# Altium schematic sheet DDR4_SDRAM.SchDoc: RFSoC AMC
size 420 x 297 mm; CompanyName: WUT; DrawnBy: T. Przywozki; Organization: WUT ISE; Address1: Warsaw University of Technology; Address2: Nowowiejska 15/19 00-665 Warsaw; Address3: Tomasz.Przywozki@pw.edu.pl; DocumentNumber: 14; Revision: 1; SheetNumber: 14; SheetTotal: 45; Project: RFSoC AMC; ModifiedBy: T. Przywozki; CreateDate: -; CheckedDate: -; DivGrp: ISE; Designer: T. Przywozki; ModifiedDate: -; ProjectName: ADC/DAC MEZZANINE
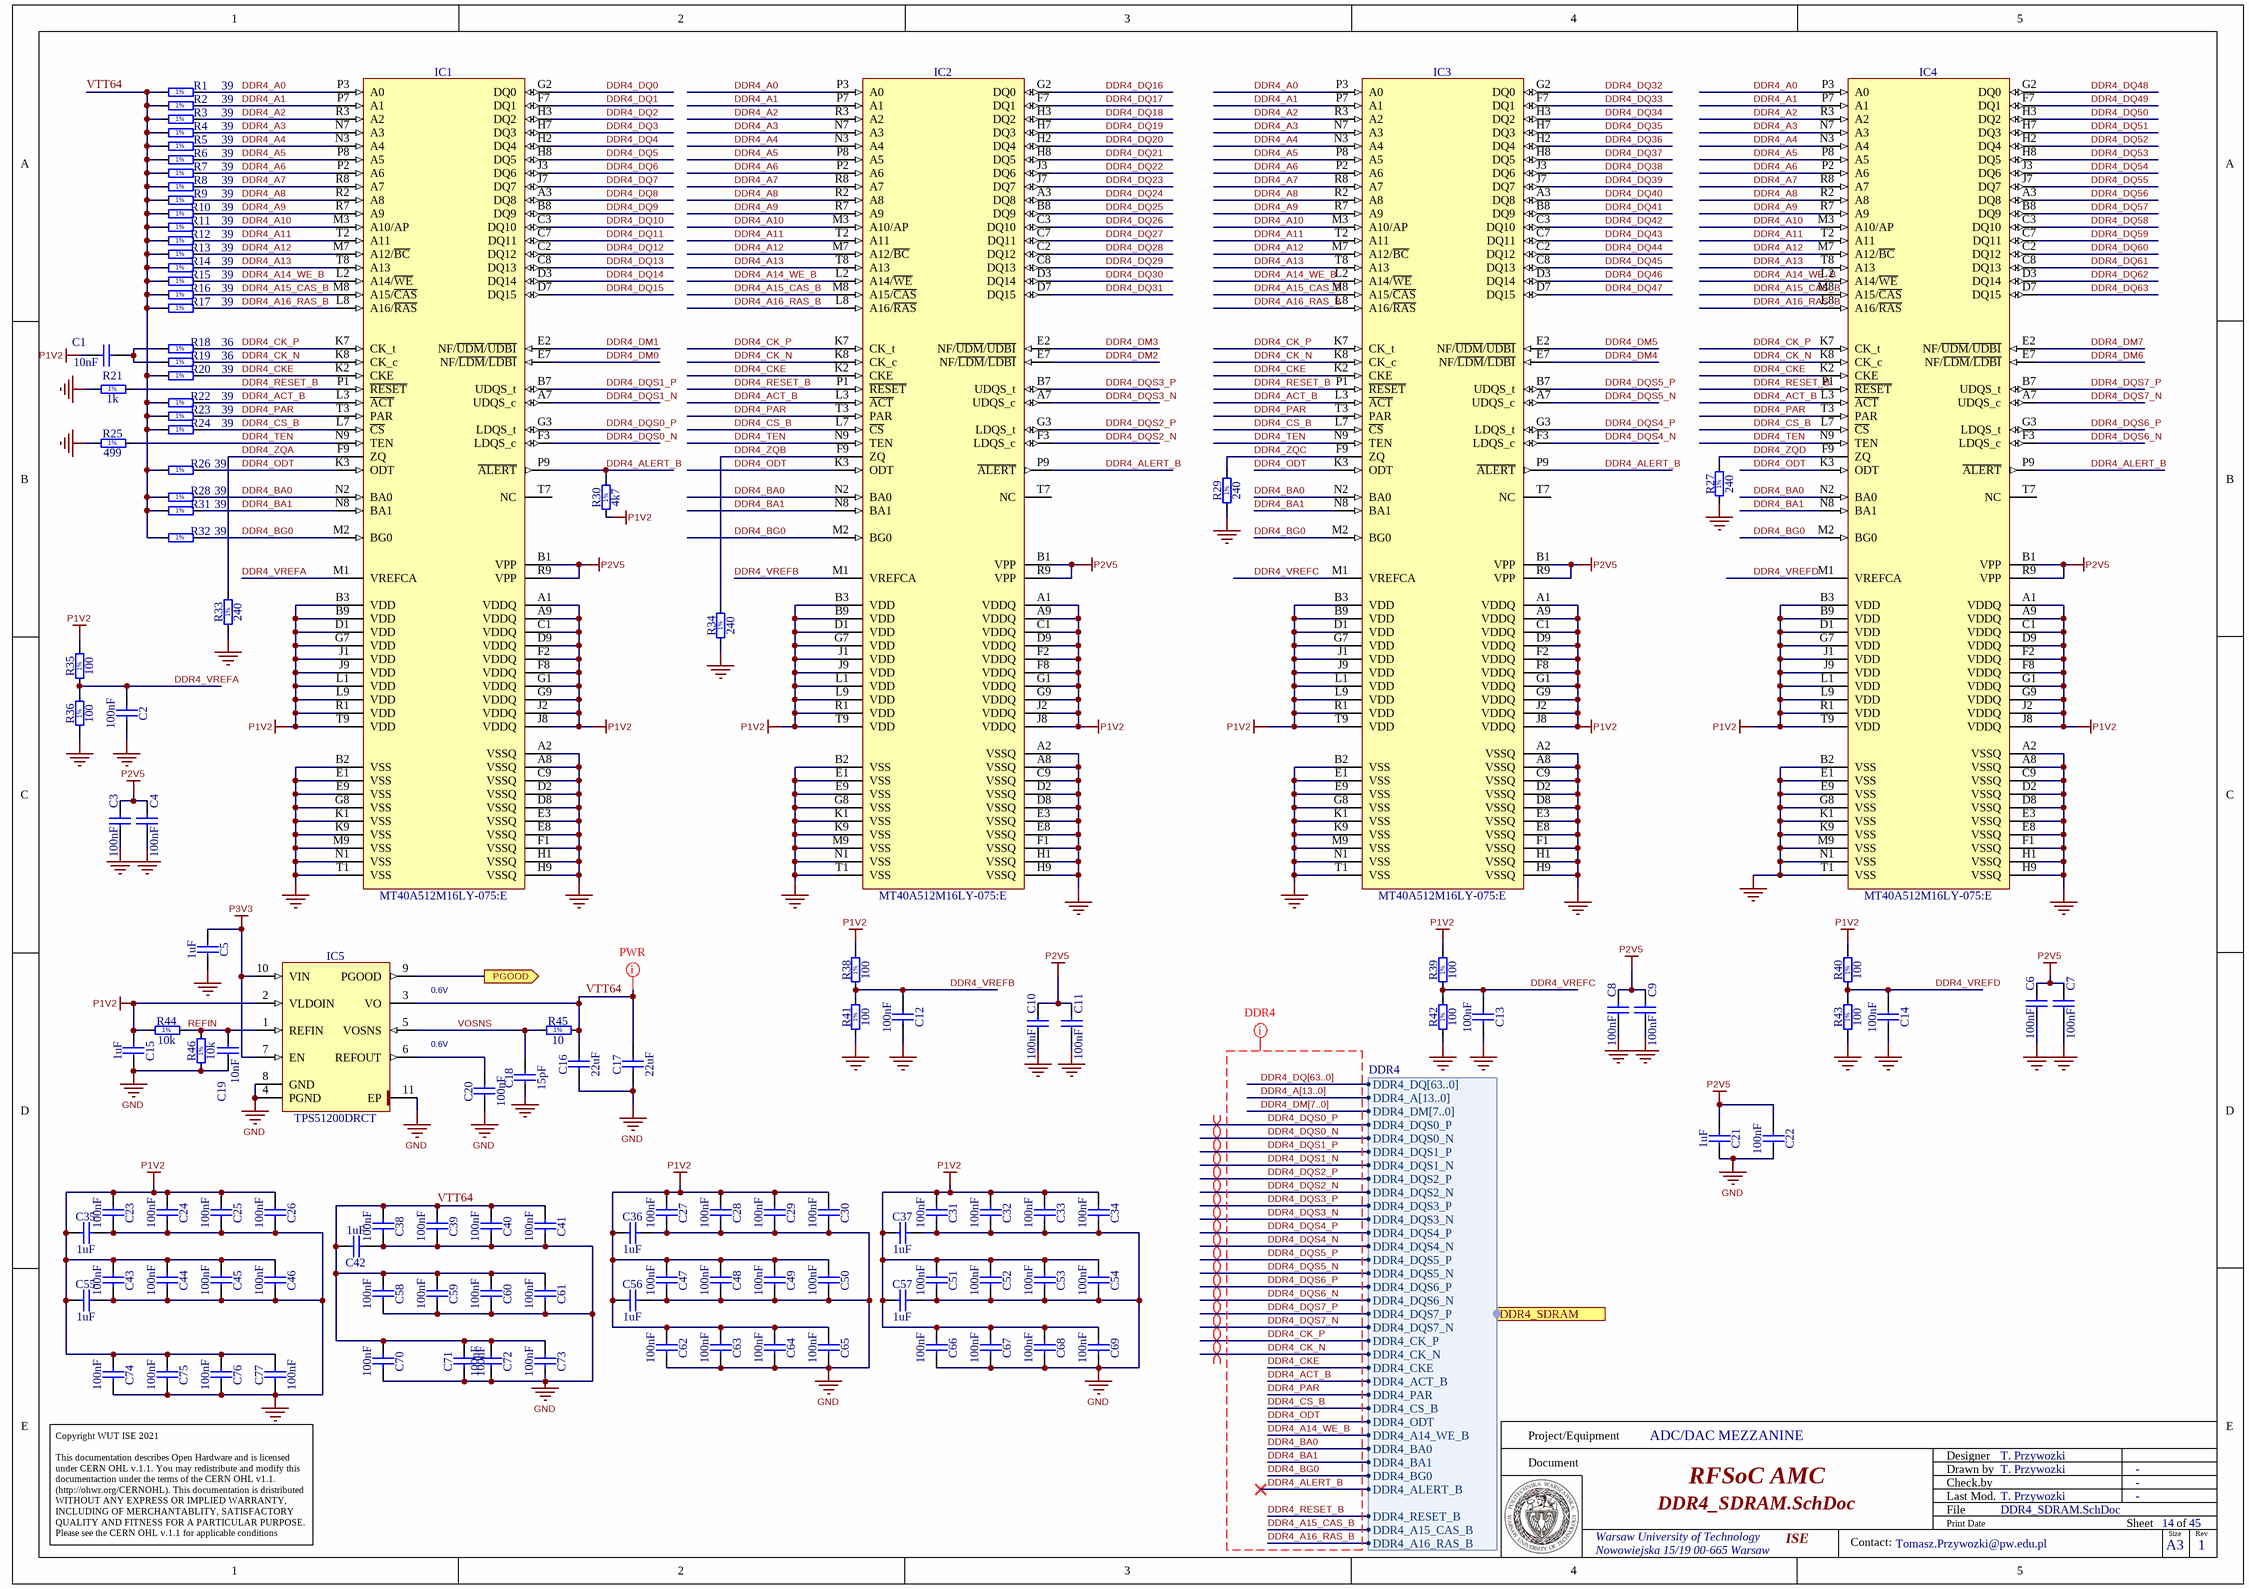
[diagram p0: DDR4_SDRAM.SchDoc]

## Parts
C1  10nF  [CAPC0603X33N]
C2  100nF  [CAPC0603X33N]
C3  100nF  [CAPC0603X33N]
C4  100nF  [CAPC0603X33N]
C5  1uF  [CAPC1005X55N]
C6  100nF  [CAPC0603X33N]
C7  100nF  [CAPC0603X33N]
C8  100nF  [CAPC0603X33N]
C9  100nF  [CAPC0603X33N]
C10  100nF  [CAPC0603X33N]
C11  100nF  [CAPC0603X33N]
C12  100nF  [CAPC0603X33N]
C13  100nF  [CAPC0603X33N]
C14  100nF  [CAPC0603X33N]
C15  1uF  [CAPC1005X55N]
C16  22uF  [CAPC2012X135N]
C17  22uF  [CAPC2012X135N]
C18  15pF  [CAPC1005X55N]
C19  10nF  [CAPC1005X55N]
C20  100nF  [CAPC0603X33N]
C21  1uF  [CAPC1005X55N]
C22  100nF  [CAPC0603X33N]
C23  100nF  [CAPC0603X33N]
C24  100nF  [CAPC0603X33N]
C25  100nF  [CAPC0603X33N]
C26  100nF  [CAPC0603X33N]
C27  100nF  [CAPC0603X33N]
C28  100nF  [CAPC0603X33N]
C29  100nF  [CAPC0603X33N]
C30  100nF  [CAPC0603X33N]
C31  100nF  [CAPC0603X33N]
C32  100nF  [CAPC0603X33N]
C33  100nF  [CAPC0603X33N]
C34  100nF  [CAPC0603X33N]
C35  1uF  [CAPC1005X55N]
C36  1uF  [CAPC1005X55N]
C37  1uF  [CAPC1005X55N]
C38  100nF  [CAPC0603X33N]
C39  100nF  [CAPC0603X33N]
C40  100nF  [CAPC0603X33N]
C41  100nF  [CAPC0603X33N]
C42  1uF  [CAPC1005X55N]
C43  100nF  [CAPC0603X33N]
C44  100nF  [CAPC0603X33N]
C45  100nF  [CAPC0603X33N]
C46  100nF  [CAPC0603X33N]
C47  100nF  [CAPC0603X33N]
C48  100nF  [CAPC0603X33N]
C49  100nF  [CAPC0603X33N]
C50  100nF  [CAPC0603X33N]
C51  100nF  [CAPC0603X33N]
C52  100nF  [CAPC0603X33N]
C53  100nF  [CAPC0603X33N]
C54  100nF  [CAPC0603X33N]
C55  1uF  [CAPC1005X55N]
C56  1uF  [CAPC1005X55N]
C57  1uF  [CAPC1005X55N]
C58  100nF  [CAPC0603X33N]
C59  100nF  [CAPC0603X33N]
C60  100nF  [CAPC0603X33N]
C61  100nF  [CAPC0603X33N]
C62  100nF  [CAPC0603X33N]
C63  100nF  [CAPC0603X33N]
C64  100nF  [CAPC0603X33N]
C65  100nF  [CAPC0603X33N]
C66  100nF  [CAPC0603X33N]
C67  100nF  [CAPC0603X33N]
C68  100nF  [CAPC0603X33N]
C69  100nF  [CAPC0603X33N]
C70  100nF  [CAPC0603X33N]
C71  100nF  [CAPC0603X33N]
C72  100nF  [CAPC0603X33N]
C73  100nF  [CAPC0603X33N]
C74  100nF  [CAPC0603X33N]
C75  100nF  [CAPC0603X33N]
C76  100nF  [CAPC0603X33N]
C77  100nF  [CAPC0603X33N]
IC1  MT40A512M16LY-075:E  [BGA96C80P9X16_750X1350X120]
IC2  MT40A512M16LY-075:E  [BGA96C80P9X16_750X1350X120]
IC3  MT40A512M16LY-075:E  [BGA96C80P9X16_750X1350X120]
IC4  MT40A512M16LY-075:E  [BGA96C80P9X16_750X1350X120]
IC5  TPS51200DRCT  [TEXAS_DRC (S-PVSON-N10)]
R1  39  [RESC1005X40N]
R2  39  [RESC1005X40N]
R3  39  [RESC1005X40N]
R4  39  [RESC1005X40N]
R5  39  [RESC1005X40N]
R6  39  [RESC1005X40N]
R7  39  [RESC1005X40N]
R8  39  [RESC1005X40N]
R9  39  [RESC1005X40N]
R10  39  [RESC1005X40N]
R11  39  [RESC1005X40N]
R12  39  [RESC1005X40N]
R13  39  [RESC1005X40N]
R14  39  [RESC1005X40N]
R15  39  [RESC1005X40N]
R16  39  [RESC1005X40N]
R17  39  [RESC1005X40N]
R18  36  [RESC1005X40N]
R19  36  [RESC1005X40N]
R20  39  [RESC1005X40N]
R21  1k  [RESC1005X40N]
R22  39  [RESC1005X40N]
R23  39  [RESC1005X40N]
R24  39  [RESC1005X40N]
R25  499  [RESC1005X40N]
R26  39  [RESC1005X40N]
R27  240  [RESC1005X40N]
R28  39  [RESC1005X40N]
R29  240  [RESC1005X40N]
R30  4k7  [RESC1005X40N]
R31  39  [RESC1005X40N]
R32  39  [RESC1005X40N]
R33  240  [RESC1005X40N]
R34  240  [RESC1005X40N]
R35  100  [RESC1005X40N]
R36  100  [RESC1005X40N]
R38  100  [RESC1005X40N]
R39  100  [RESC1005X40N]
R40  100  [RESC1005X40N]
R41  100  [RESC1005X40N]
R42  100  [RESC1005X40N]
R43  100  [RESC1005X40N]
R44  10k  [RESC1005X40N]
R45  10  [RESC1005X40N]
R46  10k  [RESC1005X40N]

## Ports
DDR4_SDRAM (harness DDR4), PGOOD (out)

## Harnesses
DDR4: DDR4_DQ[63..0], DDR4_A[13..0], DDR4_DM[7..0], DDR4_DQS0_P, DDR4_DQS0_N, DDR4_DQS1_P, DDR4_DQS1_N, DDR4_DQS2_P, DDR4_DQS2_N, DDR4_DQS3_P, DDR4_DQS3_N, DDR4_DQS4_P, DDR4_DQS4_N, DDR4_DQS5_P, DDR4_DQS5_N, DDR4_DQS6_P, DDR4_DQS6_N, DDR4_DQS7_P, DDR4_DQS7_N, DDR4_CK_P, DDR4_CK_N, DDR4_CKE, DDR4_ACT_B, DDR4_PAR, DDR4_CS_B, DDR4_ODT, DDR4_A14_WE_B, DDR4_BA0, DDR4_BA1, DDR4_BG0, DDR4_ALERT_B, DDR4_RESET_B, DDR4_A15_CAS_B, DDR4_A16_RAS_B

## Nets
GND: C2.2 C3.2 C4.2 C5.2 C6.2 C7.2 C8.2 C9.2 C10.2 C11.2 C12.2 C13.2 C14.2 C15.2 C16.1 C17.1 C18.1 C19.1 C20.1 C21.2 C22.2 C23.2 C24.2 C25.2 C26.2 C27.2 C28.2 C29.2 C30.2 C31.2 C32.2 C33.2 C34.2 C35.2 C36.2 C37.2 C38.2 C39.2 C40.2 C41.2 C42.2 C43.2 C44.2 C45.2 C46.2 C47.2 C48.2 C49.2 C50.2 C51.2 C52.2 C53.2 C54.2 C55.2 C56.2 C57.2 C58.2 C59.2 C60.2 C61.2 C62.2 C63.2 C64.2 C65.2 C66.2 C67.2 C68.2 C69.2 C70.2 C71.2 C72.2 C73.2 C74.2 C75.2 C76.2 C77.1 IC1.A2(VSSQ) IC1.A8(VSSQ) IC1.B2(VSS) IC1.C9(VSSQ) IC1.D2(VSSQ) IC1.D8(VSSQ) IC1.E1(VSS) IC1.E3(VSSQ) IC1.E8(VSSQ) IC1.E9(VSS) IC1.F1(VSSQ) IC1.G8(VSS) IC1.H1(VSSQ) IC1.H9(VSSQ) IC1.K1(VSS) IC1.K9(VSS) IC1.M9(VSS) IC1.N1(VSS) IC1.T1(VSS) IC2.A2(VSSQ) IC2.A8(VSSQ) IC2.B2(VSS) IC2.C9(VSSQ) IC2.D2(VSSQ) IC2.D8(VSSQ) IC2.E1(VSS) IC2.E3(VSSQ) IC2.E8(VSSQ) IC2.E9(VSS) IC2.F1(VSSQ) IC2.G8(VSS) IC2.H1(VSSQ) IC2.H9(VSSQ) IC2.K1(VSS) IC2.K9(VSS) IC2.M9(VSS) IC2.N1(VSS) IC2.T1(VSS) IC3.A2(VSSQ) IC3.A8(VSSQ) IC3.B2(VSS) IC3.C9(VSSQ) IC3.D2(VSSQ) IC3.D8(VSSQ) IC3.E1(VSS) IC3.E3(VSSQ) IC3.E8(VSSQ) IC3.E9(VSS) IC3.F1(VSSQ) IC3.G8(VSS) IC3.H1(VSSQ) IC3.H9(VSSQ) IC3.K1(VSS) IC3.K9(VSS) IC3.M9(VSS) IC3.N1(VSS) IC3.T1(VSS) IC4.A2(VSSQ) IC4.A8(VSSQ) IC4.B2(VSS) IC4.C9(VSSQ) IC4.D2(VSSQ) IC4.D8(VSSQ) IC4.E1(VSS) IC4.E3(VSSQ) IC4.E8(VSSQ) IC4.E9(VSS) IC4.F1(VSSQ) IC4.G8(VSS) IC4.H1(VSSQ) IC4.H9(VSSQ) IC4.K1(VSS) IC4.K9(VSS) IC4.M9(VSS) IC4.N1(VSS) IC4.T1(VSS) IC5.4(PGND) IC5.8(GND) IC5.11(EP) R21.1 R25.1 R27.1 R29.1 R33.1 R34.1 R36.1 R41.1 R42.1 R43.1 R46.1
P1V2: C1.1 C15.1 C23.1 C24.1 C25.1 C26.1 C27.1 C28.1 C29.1 C30.1 C31.1 C32.1 C33.1 C34.1 C35.1 C36.1 C37.1 C43.1 C44.1 C45.1 C46.1 C47.1 C48.1 C49.1 C50.1 C51.1 C52.1 C53.1 C54.1 C55.1 C56.1 C57.1 C62.1 C63.1 C64.1 C65.1 C66.1 C67.1 C68.1 C69.1 C74.1 C75.1 C76.1 C77.2 IC1.A1(VDDQ) IC1.A9(VDDQ) IC1.B3(VDD) IC1.B9(VDD) IC1.C1(VDDQ) IC1.D1(VDD) IC1.D9(VDDQ) IC1.F2(VDDQ) IC1.F8(VDDQ) IC1.G1(VDDQ) IC1.G7(VDD) IC1.G9(VDDQ) IC1.J1(VDD) IC1.J2(VDDQ) IC1.J8(VDDQ) IC1.J9(VDD) IC1.L1(VDD) IC1.L9(VDD) IC1.R1(VDD) IC1.T9(VDD) IC2.A1(VDDQ) IC2.A9(VDDQ) IC2.B3(VDD) IC2.B9(VDD) IC2.C1(VDDQ) IC2.D1(VDD) IC2.D9(VDDQ) IC2.F2(VDDQ) IC2.F8(VDDQ) IC2.G1(VDDQ) IC2.G7(VDD) IC2.G9(VDDQ) IC2.J1(VDD) IC2.J2(VDDQ) IC2.J8(VDDQ) IC2.J9(VDD) IC2.L1(VDD) IC2.L9(VDD) IC2.R1(VDD) IC2.T9(VDD) IC3.A1(VDDQ) IC3.A9(VDDQ) IC3.B3(VDD) IC3.B9(VDD) IC3.C1(VDDQ) IC3.D1(VDD) IC3.D9(VDDQ) IC3.F2(VDDQ) IC3.F8(VDDQ) IC3.G1(VDDQ) IC3.G7(VDD) IC3.G9(VDDQ) IC3.J1(VDD) IC3.J2(VDDQ) IC3.J8(VDDQ) IC3.J9(VDD) IC3.L1(VDD) IC3.L9(VDD) IC3.R1(VDD) IC3.T9(VDD) IC4.A1(VDDQ) IC4.A9(VDDQ) IC4.B3(VDD) IC4.B9(VDD) IC4.C1(VDDQ) IC4.D1(VDD) IC4.D9(VDDQ) IC4.F2(VDDQ) IC4.F8(VDDQ) IC4.G1(VDDQ) IC4.G7(VDD) IC4.G9(VDDQ) IC4.J1(VDD) IC4.J2(VDDQ) IC4.J8(VDDQ) IC4.J9(VDD) IC4.L1(VDD) IC4.L9(VDD) IC4.R1(VDD) IC4.T9(VDD) IC5.2(VLDOIN) R30.1 R35.2 R38.2 R39.2 R40.2 R44.1
P2V5: C3.1 C4.1 C6.1 C7.1 C8.1 C9.1 C10.1 C11.1 C21.1 C22.1 IC1.B1(VPP) IC1.R9(VPP) IC2.B1(VPP) IC2.R9(VPP) IC3.B1(VPP) IC3.R9(VPP) IC4.B1(VPP) IC4.R9(VPP)
P3V3: C5.1 IC5.7(EN) IC5.10(VIN)
DDR4_A0: IC1.P3(A0) IC2.P3(A0) IC3.P3(A0) IC4.P3(A0) R1.2
DDR4_A1: IC1.P7(A1) IC2.P7(A1) IC3.P7(A1) IC4.P7(A1) R2.2
DDR4_A2: IC1.R3(A2) IC2.R3(A2) IC3.R3(A2) IC4.R3(A2) R3.2
DDR4_A3: IC1.N7(A3) IC2.N7(A3) IC3.N7(A3) IC4.N7(A3) R4.2
DDR4_A4: IC1.N3(A4) IC2.N3(A4) IC3.N3(A4) IC4.N3(A4) R5.2
DDR4_A5: IC1.P8(A5) IC2.P8(A5) IC3.P8(A5) IC4.P8(A5) R6.2
DDR4_A6: IC1.P2(A6) IC2.P2(A6) IC3.P2(A6) IC4.P2(A6) R7.2
DDR4_A7: IC1.R8(A7) IC2.R8(A7) IC3.R8(A7) IC4.R8(A7) R8.2
DDR4_A8: IC1.R2(A8) IC2.R2(A8) IC3.R2(A8) IC4.R2(A8) R9.2
DDR4_A9: IC1.R7(A9) IC2.R7(A9) IC3.R7(A9) IC4.R7(A9) R10.2
DDR4_A10: IC1.M3(A10/AP) IC2.M3(A10/AP) IC3.M3(A10/AP) IC4.M3(A10/AP) R11.2
DDR4_A11: IC1.T2(A11) IC2.T2(A11) IC3.T2(A11) IC4.T2(A11) R12.2
DDR4_A12: IC1.M7(A12/~{BC}) IC2.M7(A12/~{BC}) IC3.M7(A12/~{BC}) IC4.M7(A12/~{BC}) R13.2
DDR4_A13: IC1.T8(A13) IC2.T8(A13) IC3.T8(A13) IC4.T8(A13) R14.2
DDR4_A14_WE_B: IC1.L2(A14/~{WE}) IC2.L2(A14/~{WE}) IC3.L2(A14/~{WE}) IC4.L2(A14/~{WE}) R15.2 ; port DDR4_SDRAM.DDR4_A14_WE_B
DDR4_A15_CAS_B: IC1.M8(A15/~{CAS}) IC2.M8(A15/~{CAS}) IC3.M8(A15/~{CAS}) IC4.M8(A15/~{CAS}) R16.2 ; port DDR4_SDRAM.DDR4_A15_CAS_B
DDR4_A16_RAS_B: IC1.L8(A16/~{RAS}) IC2.L8(A16/~{RAS}) IC3.L8(A16/~{RAS}) IC4.L8(A16/~{RAS}) R17.2 ; port DDR4_SDRAM.DDR4_A16_RAS_B
DDR4_ACT_B: IC1.L3(~{ACT}) IC2.L3(~{ACT}) IC3.L3(~{ACT}) IC4.L3(~{ACT}) R22.2 ; port DDR4_SDRAM.DDR4_ACT_B
DDR4_ALERT_B: IC1.P9(~{ALERT}) IC2.P9(~{ALERT}) IC3.P9(~{ALERT}) IC4.P9(~{ALERT}) R30.2 ; port DDR4_SDRAM.DDR4_ALERT_B
DDR4_BA0: IC1.N2(BA0) IC2.N2(BA0) IC3.N2(BA0) IC4.N2(BA0) R28.2 ; port DDR4_SDRAM.DDR4_BA0
DDR4_BA1: IC1.N8(BA1) IC2.N8(BA1) IC3.N8(BA1) IC4.N8(BA1) R31.2 ; port DDR4_SDRAM.DDR4_BA1
DDR4_BG0: IC1.M2(BG0) IC2.M2(BG0) IC3.M2(BG0) IC4.M2(BG0) R32.2 ; port DDR4_SDRAM.DDR4_BG0
DDR4_CK_N: IC1.K8(CK_c) IC2.K8(CK_c) IC3.K8(CK_c) IC4.K8(CK_c) R19.2 ; port DDR4_SDRAM.DDR4_CK_N
DDR4_CK_P: IC1.K7(CK_t) IC2.K7(CK_t) IC3.K7(CK_t) IC4.K7(CK_t) R18.2 ; port DDR4_SDRAM.DDR4_CK_P
DDR4_CKE: IC1.K2(CKE) IC2.K2(CKE) IC3.K2(CKE) IC4.K2(CKE) R20.2 ; port DDR4_SDRAM.DDR4_CKE
DDR4_CS_B: IC1.L7(~{CS}) IC2.L7(~{CS}) IC3.L7(~{CS}) IC4.L7(~{CS}) R24.2 ; port DDR4_SDRAM.DDR4_CS_B
DDR4_DM0: IC1.E7(NF/~{LDM}/~{LDBI})
DDR4_DM1: IC1.E2(NF/~{UDM}/~{UDBI})
DDR4_DM2: IC2.E7(NF/~{LDM}/~{LDBI})
DDR4_DM3: IC2.E2(NF/~{UDM}/~{UDBI})
DDR4_DM4: IC3.E7(NF/~{LDM}/~{LDBI})
DDR4_DM5: IC3.E2(NF/~{UDM}/~{UDBI})
DDR4_DM6: IC4.E7(NF/~{LDM}/~{LDBI})
DDR4_DM7: IC4.E2(NF/~{UDM}/~{UDBI})
DDR4_DQ0: IC1.G2(DQ0)
DDR4_DQ1: IC1.F7(DQ1)
DDR4_DQ2: IC1.H3(DQ2)
DDR4_DQ3: IC1.H7(DQ3)
DDR4_DQ4: IC1.H2(DQ4)
DDR4_DQ5: IC1.H8(DQ5)
DDR4_DQ6: IC1.J3(DQ6)
DDR4_DQ7: IC1.J7(DQ7)
DDR4_DQ8: IC1.A3(DQ8)
DDR4_DQ9: IC1.B8(DQ9)
DDR4_DQ10: IC1.C3(DQ10)
DDR4_DQ11: IC1.C7(DQ11)
DDR4_DQ12: IC1.C2(DQ12)
DDR4_DQ13: IC1.C8(DQ13)
DDR4_DQ14: IC1.D3(DQ14)
DDR4_DQ15: IC1.D7(DQ15)
DDR4_DQ16: IC2.G2(DQ0)
DDR4_DQ17: IC2.F7(DQ1)
DDR4_DQ18: IC2.H3(DQ2)
DDR4_DQ19: IC2.H7(DQ3)
DDR4_DQ20: IC2.H2(DQ4)
DDR4_DQ21: IC2.H8(DQ5)
DDR4_DQ22: IC2.J3(DQ6)
DDR4_DQ23: IC2.J7(DQ7)
DDR4_DQ24: IC2.A3(DQ8)
DDR4_DQ25: IC2.B8(DQ9)
DDR4_DQ26: IC2.C3(DQ10)
DDR4_DQ27: IC2.C7(DQ11)
DDR4_DQ28: IC2.C2(DQ12)
DDR4_DQ29: IC2.C8(DQ13)
DDR4_DQ30: IC2.D3(DQ14)
DDR4_DQ31: IC2.D7(DQ15)
DDR4_DQ32: IC3.G2(DQ0)
DDR4_DQ33: IC3.F7(DQ1)
DDR4_DQ34: IC3.H3(DQ2)
DDR4_DQ35: IC3.H7(DQ3)
DDR4_DQ36: IC3.H2(DQ4)
DDR4_DQ37: IC3.H8(DQ5)
DDR4_DQ38: IC3.J3(DQ6)
DDR4_DQ39: IC3.J7(DQ7)
DDR4_DQ40: IC3.A3(DQ8)
DDR4_DQ41: IC3.B8(DQ9)
DDR4_DQ42: IC3.C3(DQ10)
DDR4_DQ43: IC3.C7(DQ11)
DDR4_DQ44: IC3.C2(DQ12)
DDR4_DQ45: IC3.C8(DQ13)
DDR4_DQ46: IC3.D3(DQ14)
DDR4_DQ47: IC3.D7(DQ15)
DDR4_DQ48: IC4.G2(DQ0)
DDR4_DQ49: IC4.F7(DQ1)
DDR4_DQ50: IC4.H3(DQ2)
DDR4_DQ51: IC4.H7(DQ3)
DDR4_DQ52: IC4.H2(DQ4)
DDR4_DQ53: IC4.H8(DQ5)
DDR4_DQ54: IC4.J3(DQ6)
DDR4_DQ55: IC4.J7(DQ7)
DDR4_DQ56: IC4.A3(DQ8)
DDR4_DQ57: IC4.B8(DQ9)
DDR4_DQ58: IC4.C3(DQ10)
DDR4_DQ59: IC4.C7(DQ11)
DDR4_DQ60: IC4.C2(DQ12)
DDR4_DQ61: IC4.C8(DQ13)
DDR4_DQ62: IC4.D3(DQ14)
DDR4_DQ63: IC4.D7(DQ15)
DDR4_DQS0_N: IC1.F3(LDQS_c) ; port DDR4_SDRAM.DDR4_DQS0_N
DDR4_DQS0_P: IC1.G3(LDQS_t) ; port DDR4_SDRAM.DDR4_DQS0_P
DDR4_DQS1_N: IC1.A7(UDQS_c) ; port DDR4_SDRAM.DDR4_DQS1_N
DDR4_DQS1_P: IC1.B7(UDQS_t) ; port DDR4_SDRAM.DDR4_DQS1_P
DDR4_DQS2_N: IC2.F3(LDQS_c) ; port DDR4_SDRAM.DDR4_DQS2_N
DDR4_DQS2_P: IC2.G3(LDQS_t) ; port DDR4_SDRAM.DDR4_DQS2_P
DDR4_DQS3_N: IC2.A7(UDQS_c) ; port DDR4_SDRAM.DDR4_DQS3_N
DDR4_DQS3_P: IC2.B7(UDQS_t) ; port DDR4_SDRAM.DDR4_DQS3_P
DDR4_DQS4_N: IC3.F3(LDQS_c) ; port DDR4_SDRAM.DDR4_DQS4_N
DDR4_DQS4_P: IC3.G3(LDQS_t) ; port DDR4_SDRAM.DDR4_DQS4_P
DDR4_DQS5_N: IC3.A7(UDQS_c) ; port DDR4_SDRAM.DDR4_DQS5_N
DDR4_DQS5_P: IC3.B7(UDQS_t) ; port DDR4_SDRAM.DDR4_DQS5_P
DDR4_DQS6_N: IC4.F3(LDQS_c) ; port DDR4_SDRAM.DDR4_DQS6_N
DDR4_DQS6_P: IC4.G3(LDQS_t) ; port DDR4_SDRAM.DDR4_DQS6_P
DDR4_DQS7_N: IC4.A7(UDQS_c) ; port DDR4_SDRAM.DDR4_DQS7_N
DDR4_DQS7_P: IC4.B7(UDQS_t) ; port DDR4_SDRAM.DDR4_DQS7_P
DDR4_ODT: IC1.K3(ODT) IC2.K3(ODT) IC3.K3(ODT) IC4.K3(ODT) R26.2 ; port DDR4_SDRAM.DDR4_ODT
DDR4_PAR: IC1.T3(PAR) IC2.T3(PAR) IC3.T3(PAR) IC4.T3(PAR) R23.2 ; port DDR4_SDRAM.DDR4_PAR
DDR4_RESET_B: IC1.P1(~{RESET}) IC2.P1(~{RESET}) IC3.P1(~{RESET}) IC4.P1(~{RESET}) R21.2 ; port DDR4_SDRAM.DDR4_RESET_B
DDR4_TEN: IC1.N9(TEN) IC2.N9(TEN) IC3.N9(TEN) IC4.N9(TEN) R25.2
DDR4_VREFA: C2.1 IC1.M1(VREFCA) R35.1 R36.2
DDR4_VREFB: C12.1 IC2.M1(VREFCA) R38.1 R41.2
DDR4_VREFC: C13.1 IC3.M1(VREFCA) R39.1 R42.2
DDR4_VREFD: C14.1 IC4.M1(VREFCA) R40.1 R43.2
DDR4_ZQA: IC1.F9(ZQ) R33.2
DDR4_ZQB: IC2.F9(ZQ) R34.2
DDR4_ZQC: IC3.F9(ZQ) R29.2
DDR4_ZQD: IC4.F9(ZQ) R27.2
PGOOD: IC5.9(PGOOD) ; port PGOOD
REFIN: C19.2 IC5.1(REFIN) R44.2 R46.2
VOSNS: C18.2 IC5.5(VOSNS) R45.1
VTT64: C16.2 C17.2 C38.1 C39.1 C40.1 C41.1 C42.1 C58.1 C59.1 C60.1 C61.1 C70.1 C71.1 C72.1 C73.1 IC5.3(VO) R1.1 R2.1 R3.1 R4.1 R5.1 R6.1 R7.1 R8.1 R9.1 R10.1 R11.1 R12.1 R13.1 R14.1 R15.1 R16.1 R17.1 R20.1 R22.1 R23.1 R24.1 R26.1 R28.1 R31.1 R32.1 R45.2
NetC1_2: C1.2 R18.1 R19.1
NetC20_2: C20.2 IC5.6(REFOUT)

Not connected (* = marked no-connect by the designer): IC1 T7(NC); IC2 T7(NC); IC3 T7(NC); IC4 T7(NC)

## Buses and harness runs
bus DDR4_A[13..0]
bus DDR4_DM[7..0]
bus DDR4_DQ[63..0]

## Layout directives
differential pair; differential pair class DDR_DIFF: DDR4_CK_N, DDR4_CK_P, DDR4_DQS0_N, DDR4_DQS0_P, DDR4_DQS1_N, DDR4_DQS1_P, DDR4_DQS2_N, DDR4_DQS2_P, DDR4_DQS3_N, DDR4_DQS3_P, DDR4_DQS4_N, DDR4_DQS4_P, DDR4_DQS5_N, DDR4_DQS5_P, DDR4_DQS6_N, DDR4_DQS6_P, DDR4_DQS7_N, DDR4_DQS7_P
net class DDR4: DDR4_A14_WE_B, DDR4_A15_CAS_B, DDR4_A16_RAS_B, DDR4_A[13..0], DDR4_ACT_B, DDR4_ALERT_B, DDR4_BA0, DDR4_BA1, DDR4_BG0, DDR4_CK_N, DDR4_CK_P, DDR4_CKE, DDR4_CS_B, DDR4_DM[7..0], DDR4_DQ[63..0], DDR4_DQS0_N, DDR4_DQS0_P, DDR4_DQS1_N, DDR4_DQS1_P, DDR4_DQS2_N, DDR4_DQS2_P, DDR4_DQS3_N, DDR4_DQS3_P, DDR4_DQS4_N, DDR4_DQS4_P, DDR4_DQS5_N, DDR4_DQS5_P, DDR4_DQS6_N, DDR4_DQS6_P, DDR4_DQS7_N, DDR4_DQS7_P, DDR4_ODT, DDR4_PAR, DDR4_RESET_B
net class PWR: VTT64

## Notes on the sheet
- (near IC5) 0.6V
- 0.6V
- Project/Equipment
- Document
- Designer
- Drawn by
- Check.by
- Copyright WUT ISE 2021
  This documentation describes Open Hardware and is licensed under CERN OHL v.1.1. You may redistribute and modify this documentaction under the terms of the CERN OHL v1.1.
  (http://ohwr.org/CERNOHL). This documentation is dristributed WITHOUT ANY EXPRESS OR IMPLIED WARRANTY, INCLUDING OF MERCHANTABLITY, SATISFACTORY QUALITY AND FITNESS FOR A PARTICULAR PURPOSE. Please see the CERN OHL v.1.1 for applicable conditions
- File
- Last Mod.
- Print Date
- Sheet
- Size
- A3
- of
- Rev
- Contact:
- (in symbol R0402_1K_1%_0.0625W_100PPM) 1%
- (in symbol R0402_4K7_1%_0.0625W_100PPM) 1%
- (in symbol R0402_10K_1%_0.0625W_100PPM) 1%
- (in symbol R0402_10R_1%_0.0625W_200PPM) 1%
- (in symbol R0402_36R_1%_0.0625W_100PPM) 1%
- (in symbol R0402_39R_1%_0.0625W_100PPM) 1%
- (in symbol R0402_100R_1%_0.0625W_100PPM) 1%
- (in symbol R0402_240R_1%_0.0625W_100PPM) 1%
- (in symbol R0402_499R_1%_0.0625W_100PPM) 1%

## Library data of the parts
C1 = CC0201_10NF_10V_10%_X5R: Non-polarised capacitor; Part Description: SMD Multilayer Chip Ceramic Capacitor; Manufacturer: GENERIC; Manufacturer1 Part Number: 0201ZD103KAT2A; Voltage: 10V; TC: X5R; Tolerance: ±10%; Part Number: CC0201_10NF_10V_10%_X5R; Component Kind: Standard; Component Type: Standard; Pin Count: 2; Value: 10nF; Status: Not Recommended; Manufacturer Part Number: CC0201_10NF_10V_10%_X5R; Case: 0201; Mounted: Yes; Socket: No; SMD: Yes; Sense: No; Manufacturer1 Example: AVX; Manufacturer1 ComponentHeight: 0.33mm; HelpURL: \\cern.ch\dfs\Applications\Altium\Datasheets\CC0201_X5R_AVX.pdf; Author: CERN DEM JLC; CreateDate: 03.12.2007; LatestRevisionDate: 03.12.2007
C2-C4 C6-C14 C20 C22-C34 C38-C41 C43-C54 C58-C77 = CC0201_100NF_6.3V_10%_X5R: Non-polarised capacitor; Manufacturer: GENERIC; Part Description: SMD Multilayer Chip Ceramic Capacitor; Manufacturer1 Part Number: 02016D104KAT2A; Tolerance: ±10%; Voltage: 6.3V; TC: X5R; Manufacturer Part Number: CC0201_100NF_6.3V_10%_X5R; Part Number: CC0201_100NF_6.3V_10%_X5R; Value: 100nF; Component Kind: Standard; Component Type: Standard; Pin Count: 2; Status: Not Recommended; Case: 0201; Mounted: Yes; Socket: No; SMD: Yes; Sense: No; Manufacturer1 Example: AVX; Manufacturer1 ComponentHeight: 0.33mm; HelpURL: \\cern.ch\dfs\Applications\Altium\Datasheets\CC0201_X5R_AVX.pdf; Author: CERN DEM JLC; CreateDate: 03/12/2007; LatestRevisionDate: 03/12/2007
C5 C15 C21 C35-C37 C42 C55-C57 = CC0402_1UF_16V_10%_X5R: Non-polarised capacitor; Manufacturer: GENERIC; Part Description: SMD Multilayer Chip Ceramic Capacitor; Manufacturer1 Part Number: C1005X5R1C105KT; Tolerance: ±10%; Voltage: 16V; TC: X5R; Manufacturer Part Number: CC0402_1UF_16V_10%_X5R; Part Number: CC0402_1UF_16V_10%_X5R; Value: 1uF; Component Kind: Standard; Component Type: Standard; Pin Count: 2; Status: Preferred; Case: 0402; Mounted: Yes; Socket: No; SMD: Yes; Sense: No; Manufacturer1 Example: TDK; Manufacturer1 ComponentHeight: 0.55mm; HelpURL: \\cern.ch\dfs\Applications\Altium\Datasheets\CC0402_X5R_TDK_C.pdf; Author: CERN DEM JLC; CreateDate: 25/10/2012; LatestRevisionDate: 25/10/2012
C16 C17 = CC0805_22UF_10V_+80%-20%_Y5V: Non-polarised capacitor; Manufacturer: GENERIC; Part Description: SMD Multilayer Chip Ceramic Capacitor; Manufacturer1 Part Number: 2222 241 19881; Voltage: 10V; TC: Y5V; Manufacturer Part Number: CC0805_22UF_10V_+80%-20%_Y5V; Part Number: CC0805_22UF_10V_+80%-20%_Y5V; Tolerance: +80% -20%; Value: 22uF; Component Kind: Standard; Component Type: Standard; Pin Count: 2; Status: Preferred; Case: 0805; Mounted: Yes; Socket: No; SMD: Yes; Sense: No; Manufacturer1 Example: PHYCOMP; Manufacturer1 ComponentHeight: 1.45mm; HelpURL: \\cern.ch\dfs\Applications\Altium\Datasheets\CC0805_Y5V_PHYCOMP.pdf; Author: CERN DEM JLC; CreateDate: 03.12.2007; LatestRevisionDate: 03.12.2007
C18 = CC0402_15PF_50V_5%_C0G: Non-polarised capacitor; Manufacturer: GENERIC; Part Description: SMD Multilayer Chip Ceramic Capacitor; Manufacturer1 Part Number: C0402C150J5GACTU; Tolerance: ±5%; Voltage: 50V; TC: C0G/NP0; Manufacturer Part Number: CC0402_15PF_50V_5%_C0G; Part Number: CC0402_15PF_50V_5%_C0G; Value: 15pF; Component Kind: Standard; Component Type: Standard; Pin Count: 2; Status: Preferred; Case: 0402; Mounted: Yes; Socket: No; SMD: Yes; Sense: No; Manufacturer1 Example: KEMET; Manufacturer1 ComponentHeight: 0.55mm; HelpURL: \\cern.ch\dfs\Applications\Altium\Datasheets\CC0805_C0G_KEMET_(Commercial Grade).pdf; Author: CERN DEM JLC; CreateDate: 03.12.2007; LatestRevisionDate: 22.04.2015
C19 = CC0402_10NF_25V_10%_X7R: Non-polarised capacitor; Manufacturer: GENERIC; Part Description: SMD Multilayer Chip Ceramic Capacitor; Manufacturer1 Part Number: C1005X7R1E103KT; Tolerance: ±10%; Voltage: 25V; TC: X7R; Manufacturer Part Number: CC0402_10NF_25V_10%_X7R; Part Number: CC0402_10NF_25V_10%_X7R; Value: 10nF; Component Kind: Standard; Component Type: Standard; Pin Count: 2; Status: Preferred; Case: 0402; Mounted: Yes; Socket: No; SMD: Yes; Sense: No; Manufacturer1 Example: TDK; Manufacturer1 ComponentHeight: 0.55mm; HelpURL: \\cern.ch\dfs\Applications\Altium\Datasheets\CC0402_X7R_TDK_C.pdf; Author: CERN DEM JLC; CreateDate: 25.10.2012; LatestRevisionDate: 25.10.2012
IC1-IC4 = MT40A512M16LY-075:E: +1.2V, 8Gb (512 Meg x 16 x 8 Banks) DDR4 SDRAM; Part Description: +1.2V, 8Gb (512 Meg x 16) Automotive DDR4 SDRAM; Manufacturer: MICRON TECHNOLOGY; PressFit: No; Bonding: No; Part Number: MT40A512M16LY-075:E; Component Kind: Standard; Component Type: Standard; Device: MT40A512M16LY-075:E; PackageDescription: BGA, 0.80mm Pitch, Rect.; 96 Pin, 9 Columns X 16 Rows, Body 13.50mm X 7.50mm X 1.20mm H; Manufacturer Part Number: MT40A512M16LY-075:E; Pin Count: 96; Case: BGA96; Mounted: Yes; Socket: No; SMD: Yes; Sense: No; ComponentHeight: 1.2mm; HelpURL: \\cern.ch\dfs\Applications\Altium\Datasheets\MT40A512M16LY-075-E.pdf; Author: CERN DEM WB; CreateDate: 26.07.2019; LatestRevisionDate: 26.07.2019
IC5 = TPS51200DRCT: Sink/Source DDR Termination Regulator; Manufacturer: TEXAS INSTRUMENTS; Part Description: 3.3V Sink/Source DDR Termination Regulator; PressFit: No; Bonding: No; Manufacturer Part Number: TPS51200DRCT; PackageDescription: SON, 0.50mm Pitch, 10-pin, 3.00mm W  X 3.00mm L X 1.00mm Height, (w/thermal tab 1.75 X 2.50 mm); Part Number: TPS51200DRCT; Component Kind: Standard; Component Type: Standard; Device: TPS51200DRCT; Pin Count: 11; Case: SON10; Mounted: Yes; Socket: No; SMD: Yes; Sense: No; ComponentHeight: 1mm; HelpURL: \\cern.ch\dfs\Applications\Altium\Datasheets\TPS51200DRCT.pdf; Author: CERN DEM JLC; CreateDate: 03/02/2010; LatestRevisionDate: 06/11/2013
R1-R17 R20 R22-R24 R26 R28 R31 R32 = R0402_39R_1%_0.0625W_100PPM: Resistor - 1%; Manufacturer: GENERIC; Part Description: General Purpose Thick Film Chip Resistor; Manufacturer1 Part Number: 232270673909L; TC: ±100ppm/°C; PressFit: No; Manufacturer Part Number: R0402_39R_1%_0.0625W_100PPM; Part Number: R0402_39R_1%_0.0625W_100PPM; Tolerance: ±1%; Value: 39; Component Kind: Standard; Component Type: Standard; Pin Count: 2; Status: Not Recommended; Power: 0.0625W; Case: 0402; Mounted: Yes; Sense: No; Socket: No; SMD: Yes; Manufacturer1 Example: YAGEO PHYCOMP; Manufacturer1 ComponentHeight: 0.4mm; HelpURL: \\cern.ch\dfs\Applications\Altium\Datasheets\R0402_Phycomp_RC0402.pdf; Author: CERN DEM JLC; CreateDate: 03/12/2007; LatestRevisionDate: 17/10/2012
R18 R19 = R0402_36R_1%_0.0625W_100PPM: Resistor - 1%; Manufacturer: GENERIC; Part Description: General Purpose Thick Film Chip Resistor; Manufacturer1 Part Number: 232270673609L; TC: ±100ppm/°C; PressFit: No; Manufacturer Part Number: R0402_36R_1%_0.0625W_100PPM; Part Number: R0402_36R_1%_0.0625W_100PPM; Tolerance: ±1%; Value: 36; Component Kind: Standard; Component Type: Standard; Pin Count: 2; Status: Not Recommended; Power: 0.0625W; Case: 0402; Mounted: Yes; Sense: No; Socket: No; SMD: Yes; Manufacturer1 Example: YAGEO PHYCOMP; Manufacturer1 ComponentHeight: 0.4mm; HelpURL: \\cern.ch\dfs\Applications\Altium\Datasheets\R0402_Phycomp_RC0402.pdf; Author: CERN DEM JLC; CreateDate: 03.12.2007; LatestRevisionDate: 17.10.2012
R21 = R0402_1K_1%_0.0625W_100PPM: Resistor - 1%; Manufacturer: GENERIC; Part Description: General Purpose Thick Film Chip Resistor; Manufacturer1 Part Number: 232270671002L; TC: ±100ppm/°C; PressFit: No; Manufacturer Part Number: R0402_1K_1%_0.0625W_100PPM; Part Number: R0402_1K_1%_0.0625W_100PPM; Tolerance: ±1%; Value: 1k; Component Kind: Standard; Component Type: Standard; Pin Count: 2; Status: Not Recommended; Power: 0.0625W; Case: 0402; Mounted: Yes; Sense: No; Socket: No; SMD: Yes; Manufacturer1 Example: YAGEO PHYCOMP; Manufacturer1 ComponentHeight: 0.4mm; HelpURL: \\cern.ch\dfs\Applications\Altium\Datasheets\R0402_Phycomp_RC0402.pdf; Author: CERN DEM JLC; CreateDate: 03.12.2007; LatestRevisionDate: 17.10.2012
R25 = R0402_499R_1%_0.0625W_100PPM: Resistor - 1%; Part Description: General Purpose Thick Film Chip Resistor; Manufacturer: GENERIC; Manufacturer1 Part Number: CRCW0402499RFK; TC: ±100ppm/°C; PressFit: No; Part Number: R0402_499R_1%_0.0625W_100PPM; Component Kind: Standard; Component Type: Standard; Pin Count: 2; Value: 499; Status: None; Power: 0.0625W; Tolerance: ±1%; Manufacturer Part Number: R0402_499R_1%_0.0625W_100PPM; Case: 0402; Mounted: Yes; Sense: No; Socket: No; SMD: Yes; Manufacturer1 Example: VISHAY; Manufacturer1 ComponentHeight: 0.4mm; HelpURL: \\cern.ch\dfs\Applications\Altium\Datasheets\R0402_VISHAY_CRCW e3.pdf; Author: CERN DEM BC; CreateDate: 27.02.2020; LatestRevisionDate: 27.02.2020
R27 R29 R33 R34 = R0402_240R_1%_0.0625W_100PPM: Resistor - 1%; Manufacturer: GENERIC; Part Description: General Purpose Thick Film Chip Resistor; Manufacturer1 Part Number: 232270672401L; TC: ±100ppm/°C; PressFit: No; Manufacturer Part Number: R0402_240R_1%_0.0625W_100PPM; Part Number: R0402_240R_1%_0.0625W_100PPM; Tolerance: ±1%; Value: 240; Component Kind: Standard; Component Type: Standard; Pin Count: 2; Status: Not Recommended; Power: 0.0625W; Case: 0402; Mounted: Yes; Sense: No; Socket: No; SMD: Yes; Manufacturer1 Example: YAGEO PHYCOMP; Manufacturer1 ComponentHeight: 0.4mm; HelpURL: \\cern.ch\dfs\Applications\Altium\Datasheets\R0402_Phycomp_RC0402.pdf; Author: CERN DEM JLC; CreateDate: 03.12.2007; LatestRevisionDate: 17.10.2012
R30 = R0402_4K7_1%_0.0625W_100PPM: Resistor - 1%; Manufacturer: GENERIC; Part Description: General Purpose Thick Film Chip Resistor; Manufacturer1 Part Number: 232270674702L; TC: ±100ppm/°C; PressFit: No; Manufacturer Part Number: R0402_4K7_1%_0.0625W_100PPM; Part Number: R0402_4K7_1%_0.0625W_100PPM; Tolerance: ±1%; Value: 4k7; Component Kind: Standard; Component Type: Standard; Pin Count: 2; Status: Not Recommended; Power: 0.0625W; Case: 0402; Mounted: Yes; Sense: No; Socket: No; SMD: Yes; Manufacturer1 Example: YAGEO PHYCOMP; Manufacturer1 ComponentHeight: 0.4mm; HelpURL: \\cern.ch\dfs\Applications\Altium\Datasheets\R0402_Phycomp_RC0402.pdf; Author: CERN DEM JLC; CreateDate: 03.12.2007; LatestRevisionDate: 17.10.2012
R35 R36 R38-R43 = R0402_100R_1%_0.0625W_100PPM: Resistor - 1%; Manufacturer: GENERIC; Part Description: General Purpose Thick Film Chip Resistor; Manufacturer1 Part Number: 232270671001L; TC: ±100ppm/°C; PressFit: No; Manufacturer Part Number: R0402_100R_1%_0.0625W_100PPM; Part Number: R0402_100R_1%_0.0625W_100PPM; Tolerance: ±1%; Value: 100; Component Kind: Standard; Component Type: Standard; Pin Count: 2; Status: Not Recommended; Power: 0.0625W; Case: 0402; Mounted: Yes; Sense: No; Socket: No; SMD: Yes; Manufacturer1 Example: YAGEO PHYCOMP; Manufacturer1 ComponentHeight: 0.4mm; HelpURL: \\cern.ch\dfs\Applications\Altium\Datasheets\R0402_Phycomp_RC0402.pdf; Author: CERN DEM JLC; CreateDate: 03.12.2007; LatestRevisionDate: 17.10.2012
R44 R46 = R0402_10K_1%_0.0625W_100PPM: Resistor - 1%; Manufacturer: GENERIC; Part Description: General Purpose Thick Film Chip Resistor; Manufacturer1 Part Number: 232270671003L; TC: ±100ppm/°C; PressFit: No; Manufacturer Part Number: R0402_10K_1%_0.0625W_100PPM; Part Number: R0402_10K_1%_0.0625W_100PPM; Tolerance: ±1%; Value: 10k; Component Kind: Standard; Component Type: Standard; Pin Count: 2; Status: Not Recommended; Power: 0.0625W; Case: 0402; Mounted: Yes; Sense: No; Socket: No; SMD: Yes; Manufacturer1 Example: YAGEO PHYCOMP; Manufacturer1 ComponentHeight: 0.4mm; HelpURL: \\cern.ch\dfs\Applications\Altium\Datasheets\R0402_Phycomp_RC0402.pdf; Author: CERN DEM JLC; CreateDate: 03/12/2007; LatestRevisionDate: 17/10/2012
R45 = R0402_10R_1%_0.0625W_200PPM: Resistor - 1%; Manufacturer: GENERIC; Part Description: General Purpose Thick Film Chip Resistor; Manufacturer1 Part Number: 232270671009L; TC: ±200ppm/°C; PressFit: No; Manufacturer Part Number: R0402_10R_1%_0.0625W_200PPM; Part Number: R0402_10R_1%_0.0625W_200PPM; Tolerance: ±1%; Value: 10; Component Kind: Standard; Component Type: Standard; Pin Count: 2; Status: Not Recommended; Power: 0.0625W; Case: 0402; Mounted: Yes; Sense: No; Socket: No; SMD: Yes; Manufacturer1 Example: YAGEO PHYCOMP; Manufacturer1 ComponentHeight: 0.4mm; HelpURL: \\cern.ch\dfs\Applications\Altium\Datasheets\R0402_Phycomp_RC0402.pdf; Author: CERN DEM JLC; CreateDate: 24.06.2009; LatestRevisionDate: 17.10.2012